# Altium schematic sheet 控制器.SchDoc
size A2
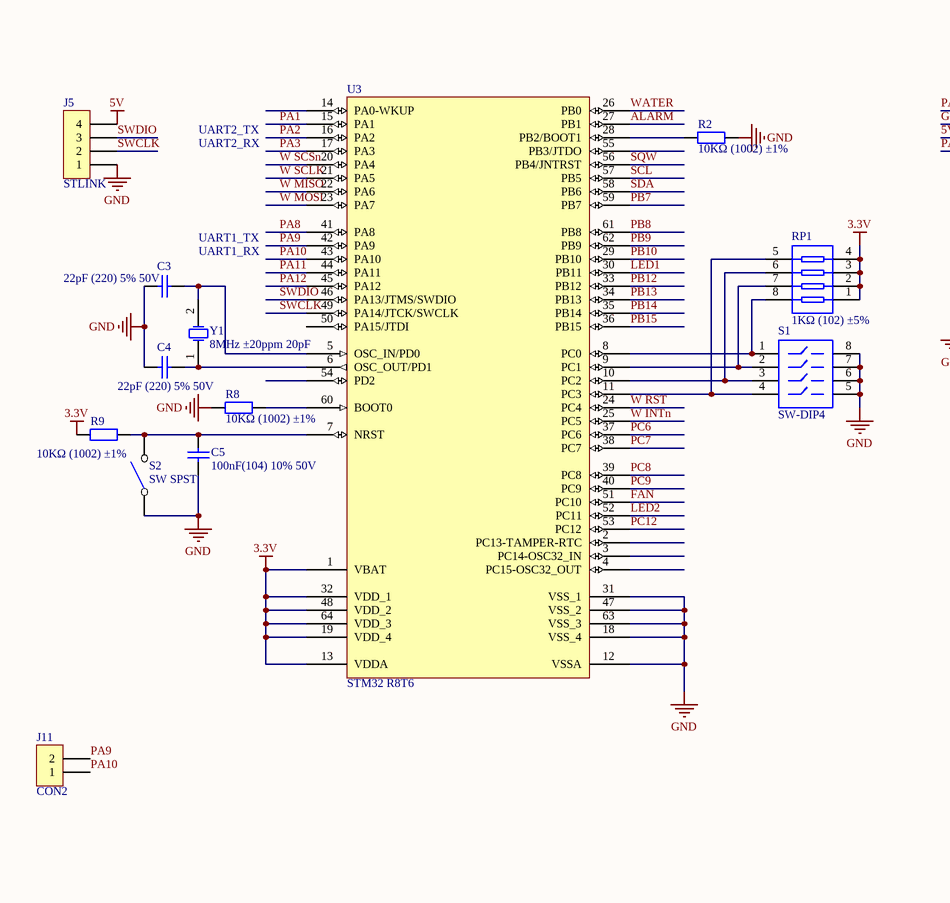
[diagram p0: 控制器.SchDoc, left]
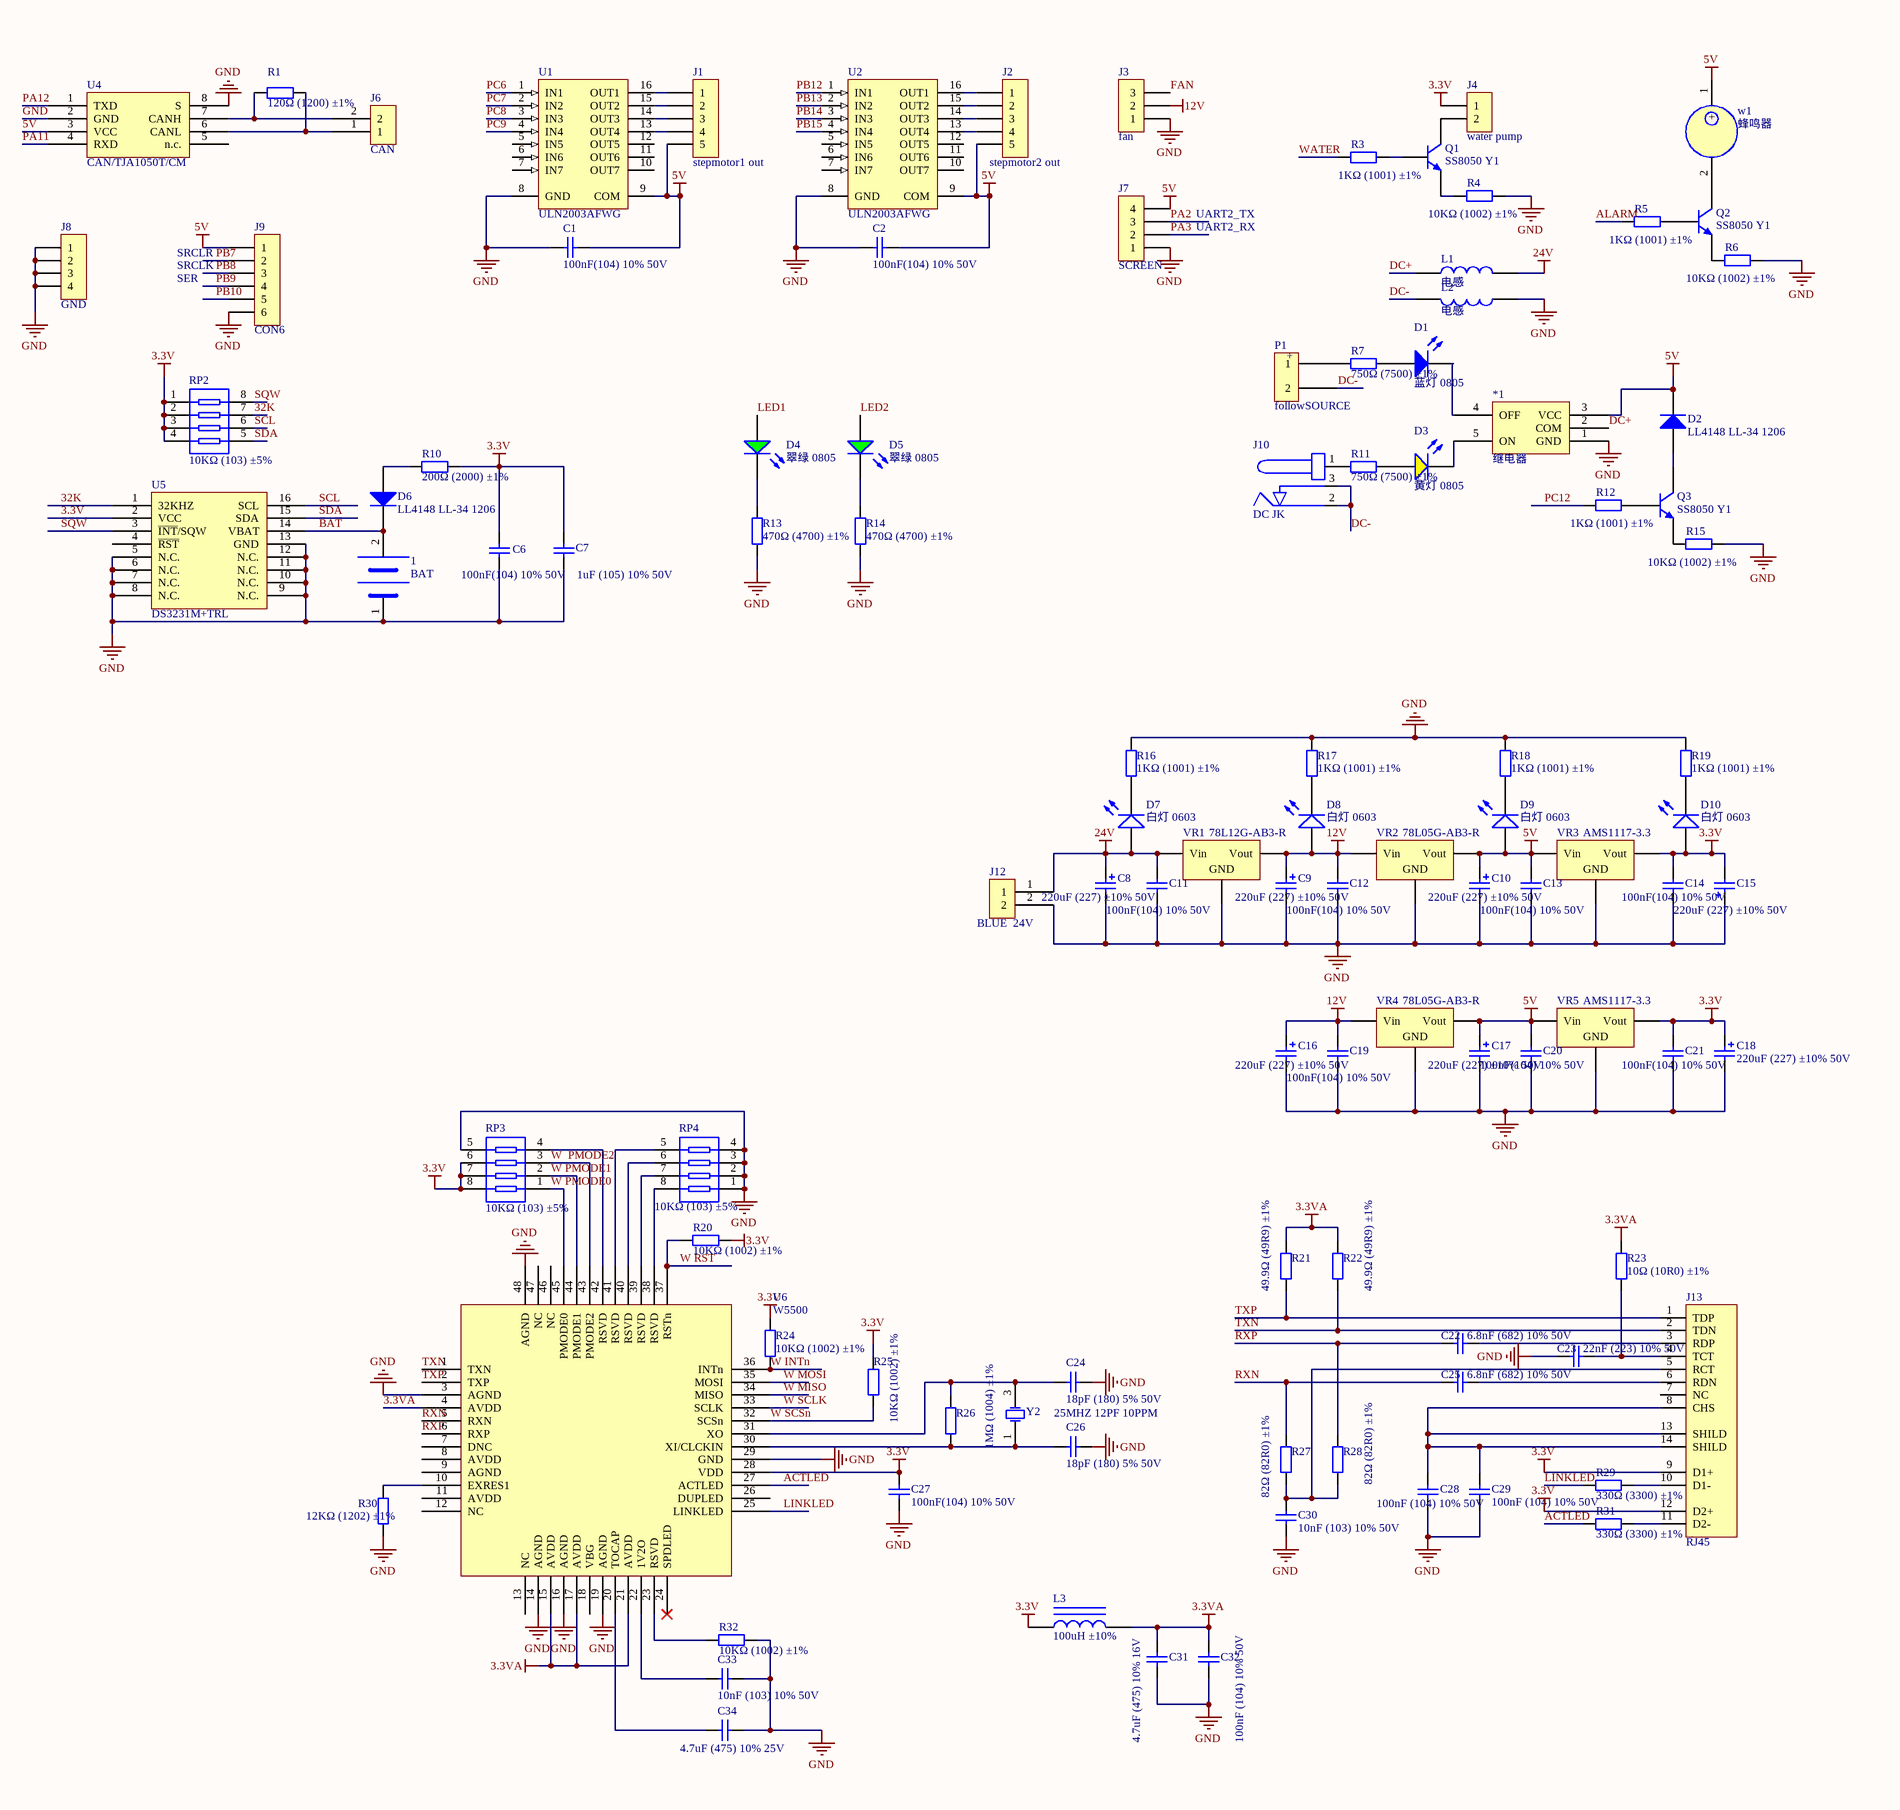
[diagram p1: 控制器.SchDoc, right]

## Parts
1  BAT  [BAT]
*1  继电器  [RLY-964]
C1  100nF(104) 10% 50V  [LC-0805_C]
C2  100nF(104) 10% 50V  [LC-0805_C]
C3  22pF (220) 5% 50V  [LC-0805_C]
C4  22pF (220) 5% 50V  [LC-0805_C]
C5  100nF(104) 10% 50V  [LC-0805_C]
C6  100nF(104) 10% 50V  [LC-0805_C]
C7  1uF (105) 10% 50V  [LC-0805_C]
C8  220uF (227) ±10% 50V  [LC-CASE-B_3528]
C9  220uF (227) ±10% 50V  [LC-CASE-B_3528]
C10  220uF (227) ±10% 50V  [LC-CASE-B_3528]
C11  100nF(104) 10% 50V  [LC-0805_C]
C12  100nF(104) 10% 50V  [LC-0805_C]
C13  100nF(104) 10% 50V  [LC-0805_C]
C14  100nF(104) 10% 50V  [LC-0805_C]
C15  220uF (227) ±10% 50V  [LC-CASE-B_3528]
C16  220uF (227) ±10% 50V  [LC-CASE-B_3528]
C17  220uF (227) ±10% 50V  [LC-CASE-B_3528]
C18  220uF (227) ±10% 50V  [LC-CASE-B_3528]
C19  100nF(104) 10% 50V  [LC-0805_C]
C20  100nF(104) 10% 50V  [LC-0805_C]
C21  100nF(104) 10% 50V  [LC-0805_C]
C22  6.8nF (682) 10% 50V  [LC-0603_C]
C23  22nF (223) 10% 50V  [LC-0603_C]
C24  18pF (180) 5% 50V  [LC-0805_C]
C25  6.8nF (682) 10% 50V  [LC-0603_C]
C26  18pF (180) 5% 50V  [LC-0805_C]
C27  100nF(104) 10% 50V  [LC-0805_C]
C28  100nF (104) 10% 50V  [LC-0603_C]
C29  100nF (104) 10% 50V  [LC-0603_C]
C30  10nF (103) 10% 50V  [LC-0603_C]
C31  4.7uF (475) 10% 16V  [LC-0603_C]
C32  100nF (104) 10% 50V  [LC-0603_C]
C33  10nF (103) 10% 50V  [LC-0805_C]
C34  4.7uF (475) 10% 25V  [LC-0805_C]
D1  蓝灯 0805  [LC-0805_LED_S1]
D2  LL4148 LL-34 1206  [LC-LL-34]
D3  黄灯 0805  [LC-0805_LED_S1]
D4  翠绿 0805  [LC-0805_LED_S1]
D5  翠绿 0805  [LC-0805_LED_S1]
D6  LL4148 LL-34 1206  [LC-LL-34]
D7  白灯 0603  [LC-0603_LED_S1]
D8  白灯 0603  [LC-0603_LED_S1]
D9  白灯 0603  [LC-0603_LED_S1]
D10  白灯 0603  [LC-0603_LED_S1]
J1  stepmotor1 out  [防反插乘5]
J2  stepmotor2 out  [防反插乘5]
J3  fan  [SIP3]
J4  water pump  [SIP2]
J5  STLINK  [SIP4]
J6  CAN  [蓝端子]
J7  SCREEN  [SIP4]
J8  GND  [SIP4]
J9  CON6  [SIP6]
J10  DC JK  [DC]
J11  CON2  [SIP2]
J12  BLUE  24V  [蓝端子]
J13  RJ45  [RJ-45_GBE]
L1  电感
L2  电感
L3  100uH ±10%  [LC-0805_L]
P1  followSOURCE  [蓝端子]
Q1  SS8050 Y1  [LC-SOT-23(SOT-23-3)]
Q2  SS8050 Y1  [LC-SOT-23(SOT-23-3)]
Q3  SS8050 Y1  [LC-SOT-23(SOT-23-3)]
R1  120Ω (1200) ±1%  [LC-0805_R]
R2  10KΩ (1002) ±1%  [LC-0805_R]
R3  1KΩ (1001) ±1%  [LC-0805_R]
R4  10KΩ (1002) ±1%  [LC-0805_R]
R5  1KΩ (1001) ±1%  [LC-0805_R]
R6  10KΩ (1002) ±1%  [LC-0805_R]
R7  750Ω (7500) ±1%  [LC-0805_R]
R8  10KΩ (1002) ±1%  [LC-0805_R]
R9  10KΩ (1002) ±1%  [LC-0805_R]
R10  200Ω (2000) ±1%  [LC-0805_R]
R11  750Ω (7500) ±1%  [LC-0805_R]
R12  1KΩ (1001) ±1%  [LC-0805_R]
R13  470Ω (4700) ±1%  [LC-0805_R]
R14  470Ω (4700) ±1%  [LC-0805_R]
R15  10KΩ (1002) ±1%  [LC-0805_R]
R16  1KΩ (1001) ±1%  [LC-0603_R]
R17  1KΩ (1001) ±1%  [LC-0603_R]
R18  1KΩ (1001) ±1%  [LC-0603_R]
R19  1KΩ (1001) ±1%  [LC-0603_R]
R20  10KΩ (1002) ±1%  [LC-0805_R]
R21  49.9Ω (49R9) ±1%  [LC-0603_R]
R22  49.9Ω (49R9) ±1%  [LC-0603_R]
R23  10Ω (10R0) ±1%  [LC-0805_R]
R24  10KΩ (1002) ±1%  [LC-0805_R]
R25  10KΩ (1002) ±1%  [LC-0805_R]
R26  1MΩ (1004) ±1%  [LC-0805_R]
R27  82Ω (82R0) ±1%  [LC-0603_R]
R28  82Ω (82R0) ±1%  [LC-0603_R]
R29  330Ω (3300) ±1%  [LC-0603_R]
R30  12KΩ (1202) ±1%  [LC-0805_R]
R31  330Ω (3300) ±1%  [LC-0603_R]
R32  10KΩ (1002) ±1%  [LC-0805_R]
RP1  1KΩ (102) ±5%  [LC-0603_Rx4]
RP2  10KΩ (103) ±5%  [LC-0603_Rx4]
RP3  10KΩ (103) ±5%  [LC-0603_Rx4]
RP4  10KΩ (103) ±5%  [LC-0603_Rx4]
S1  SW-DIP4  [4位拨码开关]
S2  SW SPST  [单片机小按键]
U1  ULN2003AFWG  [LC-SOIC-16_150mil]
U2  ULN2003AFWG  [LC-SOIC-16_150mil]
U3  STM32 R8T6  [LC-LQFP-64_10x10x05P]
U4  CAN/TJA1050T/CM  [LC-SOIC-8_150mil]
U5  DS3231M+TRL  [LC-SOIC-16_300mil]
U6  W5500  [LC-LQFP-48_7x7x05P]
VR1  78L12G-AB3-R  [LC-SOT-89(SOT-89-3)]
VR2  78L05G-AB3-R  [LC-SOT-89(SOT-89-3)]
VR3  AMS1117-3.3  [LC-SOT-223]
VR4  78L05G-AB3-R  [LC-SOT-89(SOT-89-3)]
VR5  AMS1117-3.3  [LC-SOT-223]
w1  蜂鸣器  [蜂鸣器]
Y1  8MHz ±20ppm 20pF  [LC-SMD-5032_2P]
Y2  25MHZ 12PF 10PPM  [LC-SMD-3225_4P]

## Nets
3.3V: C6.2 C7.2 C14.1 C15.2 C18.2 C21.1 C27.2 D10.A J4.1 J13.9(D1+) J13.12(D2+) L3.1 R9.1 R10.1 R20.2 R24.2 R25.2 RP1.1 RP1.2 RP1.3 RP1.4 RP2.1 RP2.2 RP2.3 RP2.4 RP3.6 RP3.7 RP3.8 U3.1(VBAT) U3.13(VDDA) U3.19(VDD_4) U3.32(VDD_1) U3.48(VDD_2) U3.64(VDD_3) U5.2(VCC) U6.28(VDD) VR3.2(Vout) VR5.2(Vout)
3.3VA: C31.2 C32.2 L3.2 R21.2 R22.2 R23.2 U6.4(AVDD) U6.15(AVDD) U6.17(AVDD) U6.21(AVDD)
5V: *1.3(VCC) C1.2 C2.2 C10.1 C13.2 C17.1 C20.1 D2.2(K) D9.A J1.5 J2.5 J5.4 J7.4 J9.1 U1.9(COM) U2.9(COM) U4.3(VCC) VR2.3(Vout) VR3.3(Vin) VR4.3(Vout) VR5.3(Vin) w1.1(+)
12V: C9.1 C12.2 C16.1 C19.2 D8.A J3.2 VR1.3(Vout) VR2.1(Vin) VR4.1(Vin)
24V: C8.1 C11.2 D7.A J12.1 L1.2 VR1.1(Vin)
GND: 1.1 *1.1(GND) C1.1 C2.1 C3.1 C4.1 C5.1 C6.1 C7.1 C8.2 C9.2 C10.2 C11.1 C12.1 C13.1 C14.2 C15.1 C16.2 C17.2 C18.2 C19.1 C20.2 C21.2 C23.1 C24.2 C26.2 C27.1 C28.1 C29.1 C30.1 C31.1 C32.1 C33.2 C34.2 J3.1 J5.1 J7.1 J8.1 J8.2 J8.3 J8.4 J9.6 J12.2 L2.1 R2.2 R4.2 R6.2 R8.1 R13.1 R14.1 R15.2 R16.1 R17.1 R18.1 R19.1 R30.1 R32.2 RP3.5 RP4.1 RP4.2 RP4.3 RP4.4 S1.5 S1.6 S1.7 S1.8 S2.1(COMMON) U1.8(GND) U2.8(GND) U3.12(VSSA) U3.18(VSS_4) U3.31(VSS_1) U3.47(VSS_2) U3.63(VSS_3) U4.2(GND) U4.8(S) U5.5(N.C.) U5.6(N.C.) U5.7(N.C.) U5.8(N.C.) U5.9(N.C.) U5.10(N.C.) U5.11(N.C.) U5.12(N.C.) U5.13(GND) U6.3(AGND) U6.14(AGND) U6.16(AGND) U6.19(AGND) U6.29(GND) U6.48(AGND) VR1.2(GND) VR2.2(GND) VR3.1(GND) VR4.2(GND) VR5.1(GND)
32K: RP2.7 U5.1(32KHZ)
ACTLED: R31.1 U6.27(ACTLED)
ALARM: R5.1 U3.27(PB1)
BAT: 1.2 D6.2(K) U5.14(VBAT)
DC+: *1.2(COM) L1.1
DC-: J10.2(GND) J10.3(GND) L2.2 P1.2
FAN: J3.3 U3.51(PC10)
LED1: D4.A U3.30(PB11)
LED2: D5.A U3.52(PC11)
LINKLED: R29.1 U6.25(LINKLED)
PA1: U3.15(PA1)
PA2: J7.3 U3.16(PA2)
PA3: J7.2 U3.17(PA3)
PA8: U3.41(PA8)
PA9: J11.2 U3.42(PA9)
PA10: J11.1 U3.43(PA10)
PA11: U3.44(PA11) U4.4(RXD)
PA12: U3.45(PA12) U4.1(TXD)
PB7: J9.2 U3.59(PB7)
PB8: J9.3 U3.61(PB8)
PB9: J9.4 U3.62(PB9)
PB10: J9.5 U3.29(PB10)
PB12: U2.1(IN1) U3.33(PB12)
PB13: U2.2(IN2) U3.34(PB13)
PB14: U2.3(IN3) U3.35(PB14)
PB15: U2.4(IN4) U3.36(PB15)
PC6: U1.1(IN1) U3.37(PC6)
PC7: U1.2(IN2) U3.38(PC7)
PC8: U1.3(IN3) U3.39(PC8)
PC9: U1.4(IN4) U3.40(PC9)
PC12: R12.1 U3.53(PC12)
RXN: C25.1 R27.2 U6.5(RXN)
RXP: C22.1 R28.2 U6.6(RXP)
SCL: RP2.6 U3.57(PB5) U5.16(SCL)
SDA: RP2.5 U3.58(PB6) U5.15(SDA)
SQW: RP2.8 U3.56(PB4/JNTRST) U5.3(~{INT}/SQW)
SWCLK: J5.2 U3.49(PA14/JTCK/SWCLK)
SWDIO: J5.3 U3.46(PA13/JTMS/SWDIO)
TXN: J13.2(TDN) R22.1 U6.1(TXN)
TXP: J13.1(TDP) R21.1 U6.2(TXP)
W  PMODE2: RP3.3 U6.43(PMODE2)
W INTn: R24.1 U3.25(PC5) U6.36(INTn)
W MISO: U3.22(PA6) U6.34(MISO)
W MOSI: U3.23(PA7) U6.35(MOSI)
W PMODE0: RP3.1 U6.45(PMODE0)
W PMODE1: RP3.2 U6.44(PMODE1)
W RST: R20.1 U3.24(PC4) U6.37(RSTn)
W SCLK: U3.21(PA5) U6.33(SCLK)
W SCSn: R25.1 U3.20(PA4) U6.32(SCSn)
WATER: R3.1 U3.26(PB0)
Net*1_4: *1.4(OFF) D1.K
Net*1_5: *1.5(ON) D3.K
NetC3_2: C3.2 U3.5(OSC_IN/PD0) Y1.2(OSC2)
NetC4_2: C4.2 U3.6(OSC_OUT/PD1) Y1.1(OSC1)
NetC5_2: C5.2 R9.2 S2.2(NO) U3.7(NRST)
NetC22_2: C22.2 J13.3(RDP)
NetC23_2: C23.2 J13.4(TCT) R23.1
NetC24_1: C24.1 R26.2 U6.31(XO) Y2.3(OSC2)
NetC25_2: C25.2 J13.6(RDN)
NetC26_1: C26.1 R26.1 U6.30(XI/CLCKIN) Y2.1(OSC1)
NetC28_2: C28.2 C29.2 J13.8(CHS) J13.13(SHILD) J13.14(SHILD)
NetC30_2: C30.2 J13.5(RCT) R27.1 R28.1
NetC33_1: C33.1 U6.22(1V2O)
NetC34_1: C34.1 U6.20(TOCAP)
NetD1_A: D1.A R7.2
NetD2_1: D2.1(A) Q3.3(C)
NetD3_A: D3.A R11.2
NetD4_K: D4.K R13.2
NetD5_K: D5.K R14.2
NetD6_1: D6.1(A) R10.2
NetD7_K: D7.K R16.2
NetD8_K: D8.K R17.2
NetD9_K: D9.K R18.2
NetD10_K: D10.K R19.2
NetJ1_1: J1.1 U1.16(OUT1)
NetJ1_2: J1.2 U1.15(OUT2)
NetJ1_3: J1.3 U1.14(OUT3)
NetJ1_4: J1.4 U1.13(OUT4)
NetJ2_1: J2.1 U2.16(OUT1)
NetJ2_2: J2.2 U2.15(OUT2)
NetJ2_3: J2.3 U2.14(OUT3)
NetJ2_4: J2.4 U2.13(OUT4)
NetJ4_2: J4.2 Q1.3(C)
NetJ6_1: J6.1 R1.2 U4.6(CANL)
NetJ6_2: J6.2 R1.1 U4.7(CANH)
NetJ10_1: J10.1(GND) R11.1
NetJ13_10: J13.10(D1-) R29.2
NetJ13_11: J13.11(D2-) R31.2
NetP1_1: P1.1 R7.1
NetQ1_1: Q1.1(B) R3.2
NetQ1_2: Q1.2(E) R4.1
NetQ2_1: Q2.1(B) R5.2
NetQ2_2: Q2.2(E) R6.1
NetQ2_3: Q2.3(C) w1.2
NetQ3_1: Q3.1(B) R12.2
NetQ3_2: Q3.2(E) R15.1
NetR2_1: R2.1 U3.28(PB2/BOOT1)
NetR8_2: R8.2 U3.60(BOOT0)
NetR30_2: R30.2 U6.10(EXRES1)
NetR32_1: R32.1 U6.23(RSVD)
NetRP1_5: RP1.5 S1.4 U3.11(PC3)
NetRP1_6: RP1.6 S1.3 U3.10(PC2)
NetRP1_7: RP1.7 S1.2 U3.9(PC1)
NetRP1_8: RP1.8 S1.1 U3.8(PC0)
NetRP3_4: RP3.4 U6.42(RSVD)
NetRP4_5: RP4.5 U6.41(RSVD)
NetRP4_6: RP4.6 U6.40(RSVD)
NetRP4_7: RP4.7 U6.39(RSVD)
NetRP4_8: RP4.8 U6.38(RSVD)

Not connected (* = marked no-connect by the designer): J13 7(NC); U1 5(IN5) 6(IN6) 7(IN7) 10(OUT7) 11(OUT6) 12(OUT5); U2 5(IN5) 6(IN6) 7(IN7) 10(OUT7) 11(OUT6) 12(OUT5); U3 2(PC13-TAMPER-RTC) 3(PC14-OSC32_IN) 4(PC15-OSC32_OUT) 14(PA0-WKUP) 50(PA15/JTDI) 54(PD2) 55(PB3/JTDO); U4 5(n.c.); U5 4(~{RST}); U6 7(DNC) 8(AVDD) 9(AGND) 11(AVDD) 12(NC) 13(NC) 18(VBG) 24(SPDLED)* 26(DUPLED) 46(NC) 47(NC)

## Notes on the sheet
- UART2_TX
- UART2_RX
- (near C3) UART1_TX
- (near C3) UART1_RX
- (near J9) SRCLR
- (near J9) SRCLK
- SER
- (near P1) +

## Library data of the parts
C1 C2 C5 C6 C11-C14 C19-C21 C27 = 0805 100nF(104) 10% 50V: 贴片电容; ComponentLink1Description: 供应商链接; ComponentLink1URL: http://www.szlcsc.com/product/details_50686.html; Package: 0805; Supplier: LC; SuppliersPartNumber: C49678
C3 C4 = 0805 22pF (220) 5% 50V: 贴片电容; ComponentLink1Description: 供应商链接; ComponentLink1URL: http://www.szlcsc.com/product/details_2156.html; Package: 0805; Supplier: LC; SuppliersPartNumber: C1804
C7 = 0805 1uF (105) 10% 50V: 贴片电容; ComponentLink1Description: 供应商链接; ComponentLink1URL: http://www.szlcsc.com/product/details_29074.html; Package: 0805; Supplier: LC; SuppliersPartNumber: C28323
C8-C10 C15-C18 = 3528 100uF (107) 10% 6.3V: 钽电容; ComponentLink1Description: 供应商链接; ComponentLink1URL: http://www.szlcsc.com/product/details_16815.html; Package: 3528; Supplier: LC; SuppliersPartNumber: C16133
C22 C25 = 0603 6.8nF (682) 10% 50V: 贴片电容; ComponentLink1Description: 供应商链接; ComponentLink1URL: http://www.szlcsc.com/product/details_1983.html; Package: 0603; Supplier: LC; SuppliersPartNumber: C1631
C23 = 0603 22nF (223) 10% 50V: 贴片电容; ComponentLink1Description: 供应商链接; ComponentLink1URL: http://www.szlcsc.com/product/details_21834.html; Package: 0603; Supplier: LC; SuppliersPartNumber: C21122
C24 C26 = 0805 18pF (180) 5% 50V: 贴片电容; ComponentLink1Description: 供应商链接; ComponentLink1URL: http://www.szlcsc.com/product/details_2149.html; Package: 0805; Supplier: LC; SuppliersPartNumber: C1797
C28 C29 C32 = 0603 100nF (104) 10% 50V: 贴片电容; ComponentLink1Description: 供应商链接; ComponentLink1URL: http://www.szlcsc.com/product/details_15331.html; Package: 0603; Supplier: LC; SuppliersPartNumber: C14663
C30 = 0603 10nF (103) 10% 50V: 贴片电容; ComponentLink1Description: 供应商链接; ComponentLink1URL: http://www.szlcsc.com/product/details_58143.html; Package: 0603; Supplier: LC; SuppliersPartNumber: C57112
C31 = 0603 4.7uF (475) 10% 16V: 贴片电容; ComponentLink1Description: 供应商链接; ComponentLink1URL: http://www.szlcsc.com/product/details_20375.html; Package: 0603; Supplier: LC; SuppliersPartNumber: C19666
C33 = 0805 10nF (103) 10% 50V: 贴片电容; ComponentLink1Description: 供应商链接; ComponentLink1URL: http://www.szlcsc.com/product/details_2062.html; Package: 0805; Supplier: LC; SuppliersPartNumber: C1710
C34 = 0805 4.7uF (475) 10% 25V: 贴片电容; ComponentLink1Description: 供应商链接; ComponentLink1URL: http://www.szlcsc.com/product/details_2131.html; Package: 0805; Supplier: LC; SuppliersPartNumber: C1779
D1 = 0805 蓝灯: 发光二极管; ComponentLink1Description: 供应商链接; ComponentLink1URL: http://www.szlcsc.com/product/details_2666.html; Package: 0805; Supplier: LC; SuppliersPartNumber: C2293
D2 D6 = LL-34 LL4148 LL-34 1206: 开关二极管; ComponentLink1Description: 供应商链接; ComponentLink1URL: http://www.szlcsc.com/product/details_10338.html; Package: LL-34; Supplier: LC; SuppliersPartNumber: C9808
D3 = 0805 黄灯: 发光二极管; ComponentLink1Description: 供应商链接; ComponentLink1URL: http://www.szlcsc.com/product/details_2669.html; Package: 0805; Supplier: LC; SuppliersPartNumber: C2296
D4 D5 = 0805 翠绿: 发光二极管; ComponentLink1Description: 供应商链接; ComponentLink1URL: http://www.szlcsc.com/product/details_2670.html; Package: 0805; Supplier: LC; SuppliersPartNumber: C2297
D7-D10 = 0603 白灯: 发光二极管; ComponentLink1Description: 供应商链接; ComponentLink1URL: http://www.szlcsc.com/product/details_2663.html; Package: 0603; Supplier: LC; SuppliersPartNumber: C2290
J1 J2 = CON5
J3 = CON3
J4 = CON2
J5 J7 J8 = CON4
J6 J12 P1 = 蓝端子
L3 = 0805 100uH 10%: 贴片电感; ComponentLink1Description: 供应商链接; ComponentLink1URL: http://www.szlcsc.com/product/details_69137.html; Package: 0805; Supplier: LC; SuppliersPartNumber: C68035
Q1-Q3 = SOT-23 SS8050 Y1: 三极管; ComponentLink1Description: 供应商链接; ComponentLink1URL: http://www.szlcsc.com/product/details_2507.html; Package: SOT-23; Supplier: LC; SuppliersPartNumber: C2150
R1 = 0805 120Ω (1200) 1%: 贴片电阻; ComponentLink1Description: 供应商链接; ComponentLink1URL: http://www.szlcsc.com/product/details_18125.html; Package: 0805; Supplier: LC; SuppliersPartNumber: C17437
R2 R4 R6 R8 R9 R15 R20 R24 R25 R32 = 0805 10KΩ (1002) 1%: 贴片电阻; ComponentLink1Description: 供应商链接; ComponentLink1URL: http://www.szlcsc.com/product/details_18102.html; Package: 0805; Supplier: LC; SuppliersPartNumber: C17414
R3 R5 R12 = 0805 1KΩ (1001) 1%: 贴片电阻; ComponentLink1Description: 供应商链接; ComponentLink1URL: http://www.szlcsc.com/product/details_18201.html; Package: 0805; Supplier: LC; SuppliersPartNumber: C17513
R7 R11 = 0805 750Ω (7500) 1%: 贴片电阻; ComponentLink1Description: 供应商链接; ComponentLink1URL: http://www.szlcsc.com/product/details_18506.html; Package: 0805; Supplier: LC; SuppliersPartNumber: C17818
R10 = 0805 200Ω (2000) 1%: 贴片电阻; ComponentLink1Description: 供应商链接; ComponentLink1URL: http://www.szlcsc.com/product/details_18228.html; Package: 0805; Supplier: LC; SuppliersPartNumber: C17540
R13 R14 = 0805 470Ω (4700) 1%: 贴片电阻; ComponentLink1Description: 供应商链接; ComponentLink1URL: http://www.szlcsc.com/product/details_18398.html; Package: 0805; Supplier: LC; SuppliersPartNumber: C17710
R16-R19 = 0603 1KΩ (1001) 1%: 贴片电阻; ComponentLink1Description: 供应商链接; ComponentLink1URL: http://www.szlcsc.com/product/details_21904.html; Package: 0603; Supplier: LC; SuppliersPartNumber: C21190
R21 R22 = 0603 49.9Ω (49R9) 1%: 贴片电阻; ComponentLink1Description: 供应商链接; ComponentLink1URL: http://www.szlcsc.com/product/details_23912.html; Package: 0603; Supplier: LC; SuppliersPartNumber: C23185
R23 = 0805 10Ω (10R0) 1%: 贴片电阻; ComponentLink1Description: 供应商链接; ComponentLink1URL: http://www.szlcsc.com/product/details_18103.html; Package: 0805; Supplier: LC; SuppliersPartNumber: C17415
R26 = 0805 1MΩ (1004) 1%: 贴片电阻; ComponentLink1Description: 供应商链接; ComponentLink1URL: http://www.szlcsc.com/product/details_18202.html; Package: 0805; Supplier: LC; SuppliersPartNumber: C17514
R27 R28 = 0603 82Ω (82R0) 1%: 贴片电阻; ComponentLink1Description: 供应商链接; ComponentLink1URL: http://www.szlcsc.com/product/details_23982.html; Package: 0603; Supplier: LC; SuppliersPartNumber: C23255
R29 R31 = 0603 330Ω (3300) 1%: 贴片电阻; ComponentLink1Description: 供应商链接; ComponentLink1URL: http://www.szlcsc.com/product/details_23865.html; Package: 0603; Supplier: LC; SuppliersPartNumber: C23138
R30 = 0805 12KΩ (1202) 1%: 贴片电阻; ComponentLink1Description: 供应商链接; ComponentLink1URL: http://www.szlcsc.com/product/details_18132.html; Package: 0805; Supplier: LC; SuppliersPartNumber: C17444
RP1 = 0603*4  1KΩ (102) 5%: 贴片排阻; ComponentLink1Description: 供应商链接; ComponentLink1URL: http://www.szlcsc.com/product/details_20907.html; Package: 0603*4; Supplier: LC; SuppliersPartNumber: C20197
RP2-RP4 = 0603*4  10KΩ (103) 5%: 贴片排阻; ComponentLink1Description: 供应商链接; ComponentLink1URL: http://www.szlcsc.com/product/details_30472.html; Package: 0603*4; Supplier: LC; SuppliersPartNumber: C29718
S1 = SW-DIP4: 4位拨码开关
S2 = SW SPST: 单刀单掷开关
U1 U2 = ULN2003AFWG: 大电流驱动; ComponentLink1Description: 供应商链接; ComponentLink1URL: http://www.szlcsc.com/product/details_5880.html; Package: SOIC-16_150mil; Supplier: LC; SuppliersPartNumber: C5437
U4 = CAN/TJA1050T/CM: CAN; ComponentLink1Description: 供应商链接; ComponentLink1URL: http://www.szlcsc.com/product/details_7424.html; Package: SOIC-8_150mil; Supplier: LC; SuppliersPartNumber: C6952
U5 = DS3231M+TRL: 实时时钟; ComponentLink1Description: 供应商链接; ComponentLink1URL: http://www.szlcsc.com/product/details_38643.html; Package: SOIC-16_300mil; Supplier: LC; SuppliersPartNumber: C37663
U6 = W5500: 以太网; ComponentLink1Description: 供应商链接; ComponentLink1URL: http://www.szlcsc.com/product/details_33808.html; Package: LQFP-48_7x7x05P; Supplier: LC; SuppliersPartNumber: C32843
VR1 = SOT-89 78L12G-AB3-R: 低压差线性稳压(LDO); ComponentLink1Description: 供应商链接; ComponentLink1URL: http://www.szlcsc.com/product/details_76626.html; Package: SOT-89; Supplier: LC; SuppliersPartNumber: C75501
VR2 VR4 = SOT-89 78L05G-AB3-R: 低压差线性稳压(LDO); ComponentLink1Description: 供应商链接; ComponentLink1URL: http://www.szlcsc.com/product/details_72235.html; Package: SOT-89; Supplier: LC; SuppliersPartNumber: C71136
VR3 VR5 = SOT-223 AMS1117-3.3: 低压差线性稳压(LDO); ComponentLink1Description: 供应商链接; ComponentLink1URL: http://www.szlcsc.com/product/details_6652.html; Package: SOT-223; Supplier: LC; SuppliersPartNumber: C6186
Y1 = SMD-5032_2P 8MHz 20ppm 20pF: 贴片晶振; ComponentLink1Description: 供应商链接; ComponentLink1URL: http://www.szlcsc.com/product/details_19261.html; Package: SMD-5032_2P; Supplier: LC; SuppliersPartNumber: C18560
Y2 = SMD-3225_4P  25MHZ 12PF 10PPM: 贴片晶振; ComponentLink1Description: 供应商链接; ComponentLink1URL: http://www.szlcsc.com/product/details_9526.html; Package: SMD-3225_4P; Supplier: LC; SuppliersPartNumber: C9006